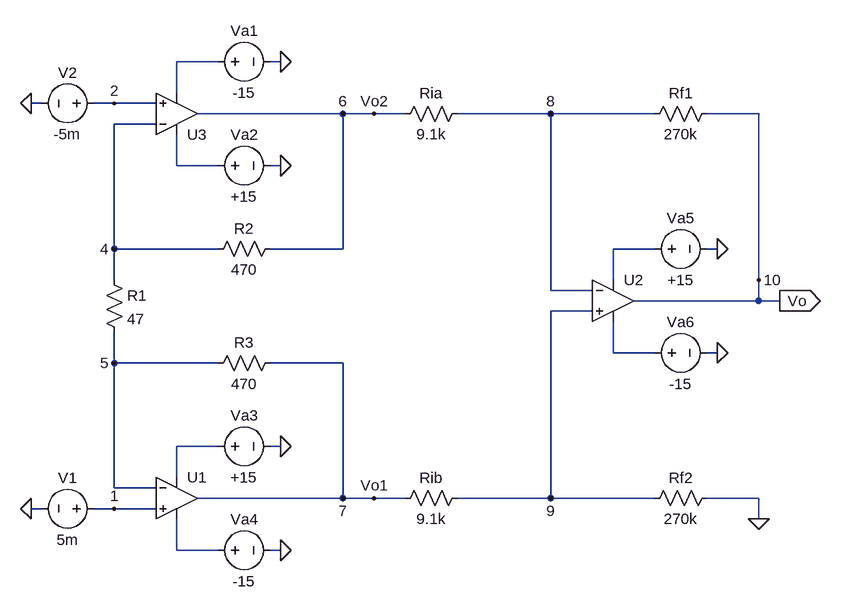
[diagram p0: schematic Run_1_B.asc]
Run_1_B.asc, the LTspice schematic file:
Version 4
SHEET 1 880 680
WIRE -144 -272 -208 -272
WIRE -48 -272 -64 -272
WIRE -208 -224 -208 -272
WIRE -416 -208 -432 -208
WIRE -304 -208 -336 -208
WIRE -240 -208 -304 -208
WIRE 48 -192 -176 -192
WIRE 96 -192 48 -192
WIRE 144 -192 96 -192
WIRE 368 -192 224 -192
WIRE 528 -192 368 -192
WIRE 688 -192 608 -192
WIRE -240 -176 -304 -176
WIRE -208 -112 -208 -160
WIRE -144 -112 -208 -112
WIRE -48 -112 -64 -112
WIRE -304 16 -304 -176
WIRE -144 16 -304 16
WIRE 48 16 48 -192
WIRE 48 16 -64 16
WIRE 528 16 464 16
WIRE 624 16 608 16
WIRE -304 64 -304 16
WIRE 464 64 464 16
WIRE 688 64 688 -192
WIRE 368 80 368 -192
WIRE 432 80 368 80
WIRE 688 96 688 64
WIRE 688 96 496 96
WIRE 720 96 688 96
WIRE 432 112 368 112
WIRE 464 176 464 128
WIRE 528 176 464 176
WIRE 624 176 608 176
WIRE -304 192 -304 144
WIRE -144 192 -304 192
WIRE 48 192 -64 192
WIRE -144 320 -208 320
WIRE -48 320 -64 320
WIRE -208 368 -208 320
WIRE -304 384 -304 192
WIRE -240 384 -304 384
WIRE 48 400 48 192
WIRE 48 400 -176 400
WIRE 96 400 48 400
WIRE 144 400 96 400
WIRE 368 400 368 112
WIRE 368 400 224 400
WIRE 528 400 368 400
WIRE 688 400 608 400
WIRE -416 416 -432 416
WIRE -304 416 -336 416
WIRE -240 416 -304 416
WIRE 688 432 688 400
WIRE -208 480 -208 432
WIRE -144 480 -208 480
WIRE -48 480 -64 480
FLAG -48 -112 0
FLAG -48 -272 0
FLAG -48 480 0
FLAG -48 320 0
FLAG 624 176 0
FLAG 624 16 0
FLAG 720 96 Vo
IOPIN 720 96 Out
FLAG 688 432 0
FLAG -304 416 1
FLAG -304 -208 2
FLAG -304 16 4
FLAG -304 192 5
FLAG 368 -192 8
FLAG 368 400 9
FLAG 688 64 10
FLAG 48 -192 6
FLAG 48 400 7
FLAG 96 -192 Vo2
FLAG 96 400 Vo1
FLAG -432 416 0
FLAG -432 -208 0
SYMBOL voltage -160 -272 R270
WINDOW 0 32 56 VTop 2
WINDOW 3 -32 56 VBottom 2
WINDOW 123 0 0 Left 0
WINDOW 39 0 0 Left 0
SYMATTR InstName Va1
SYMATTR Value -15
SYMBOL voltage -160 -112 R270
WINDOW 0 32 56 VTop 2
WINDOW 3 -32 56 VBottom 2
WINDOW 123 0 0 Left 0
WINDOW 39 0 0 Left 0
SYMATTR InstName Va2
SYMATTR Value +15
SYMBOL res -320 48 R0
SYMATTR InstName R1
SYMATTR Value 47
SYMBOL res 240 -208 R90
WINDOW 0 0 56 VBottom 2
WINDOW 3 32 56 VTop 2
SYMATTR InstName Ria
SYMATTR Value 9.1k
SYMBOL res -48 0 R90
WINDOW 0 0 56 VBottom 2
WINDOW 3 32 56 VTop 2
SYMATTR InstName R2
SYMATTR Value 470
SYMBOL res -48 176 R90
WINDOW 0 0 56 VBottom 2
WINDOW 3 32 56 VTop 2
SYMATTR InstName R3
SYMATTR Value 470
SYMBOL OpAmps\\UniversalOpamp2 -208 400 R0
SYMATTR InstName U1
SYMBOL voltage -160 320 R270
WINDOW 0 32 56 VTop 2
WINDOW 3 -32 56 VBottom 2
WINDOW 123 0 0 Left 0
WINDOW 39 0 0 Left 0
SYMATTR InstName Va3
SYMATTR Value +15
SYMBOL voltage -160 480 R270
WINDOW 0 32 56 VTop 2
WINDOW 3 -32 56 VBottom 2
WINDOW 123 0 0 Left 0
WINDOW 39 0 0 Left 0
SYMATTR InstName Va4
SYMATTR Value -15
SYMBOL res 240 384 R90
WINDOW 0 0 56 VBottom 2
WINDOW 3 32 56 VTop 2
SYMATTR InstName Rib
SYMATTR Value 9.1k
SYMBOL OpAmps\\UniversalOpamp2 464 96 R0
SYMATTR InstName U2
SYMBOL voltage 512 16 R270
WINDOW 0 32 56 VTop 2
WINDOW 3 -32 56 VBottom 2
WINDOW 123 0 0 Left 0
WINDOW 39 0 0 Left 0
SYMATTR InstName Va5
SYMATTR Value +15
SYMBOL voltage 512 176 R270
WINDOW 0 32 56 VTop 2
WINDOW 3 -32 56 VBottom 2
WINDOW 123 0 0 Left 0
WINDOW 39 0 0 Left 0
SYMATTR InstName Va6
SYMATTR Value -15
SYMBOL res 624 -208 R90
WINDOW 0 0 56 VBottom 2
WINDOW 3 32 56 VTop 2
SYMATTR InstName Rf1
SYMATTR Value 270k
SYMBOL res 624 384 R90
WINDOW 0 0 56 VBottom 2
WINDOW 3 32 56 VTop 2
SYMATTR InstName Rf2
SYMATTR Value 270k
SYMBOL OpAmps\\UniversalOpamp2 -208 -192 M180
SYMATTR InstName U3
SYMBOL voltage -320 416 R90
WINDOW 0 -32 56 VBottom 2
WINDOW 3 32 56 VTop 2
WINDOW 123 0 0 Left 0
WINDOW 39 0 0 Left 0
SYMATTR InstName V1
SYMATTR Value 5m
SYMBOL voltage -320 -208 R90
WINDOW 0 -32 56 VBottom 2
WINDOW 3 32 56 VTop 2
WINDOW 123 0 0 Left 0
WINDOW 39 0 0 Left 0
SYMATTR InstName V2
SYMATTR Value -5m

The netlist it stands for:
* Run_1_B.asc
Va1 N001 0 -15
Va2 N002 0 +15
R1 4 5 47
Ria 8 Vo2 9.1k
R2 Vo2 4 470
R3 Vo1 5 470
XU1 1 5 N005 N006 Vo1 level.2 Avol=1Meg GBW=10Meg Slew=10Meg ilimit=25m rail=0 Vos=0 phimargin=45 en=0 enk=0 in=0 ink=0 Rin=500Meg  ; pins IN+ IN- V+ V- OUT
Va3 N005 0 +15
Va4 N006 0 -15
Rib 9 Vo1 9.1k
XU2 9 8 N003 N004 10 level.2 Avol=1Meg GBW=10Meg Slew=10Meg ilimit=25m rail=0 Vos=0 phimargin=45 en=0 enk=0 in=0 ink=0 Rin=500Meg  ; pins IN+ IN- V+ V- OUT
Va5 N003 0 +15
Va6 N004 0 -15
Rf1 10 8 270k
Rf2 0 9 270k
XU3 2 4 N002 N001 Vo2 level.2 Avol=1Meg GBW=10Meg Slew=10Meg ilimit=25m rail=0 Vos=0 phimargin=45 en=0 enk=0 in=0 ink=0 Rin=500Meg  ; pins IN+ IN- V+ V- OUT
V1 1 0 5m
V2 2 0 -5m
.lib UniversalOpamps2.sub
.backanno
.end